# EasyEDA Pro project ProPrj_ExternalProgrammer.epro

# Schematic Schematic1
Board Name: Board1; Create Date: 2026-05-19; Page Name: P1; Project Name: ExternalProgrammer; Schematic Name: Schematic1; Update Date: 2026-05-19; Company: EasyEDA.com; Page Size: A4; Version: V1.0
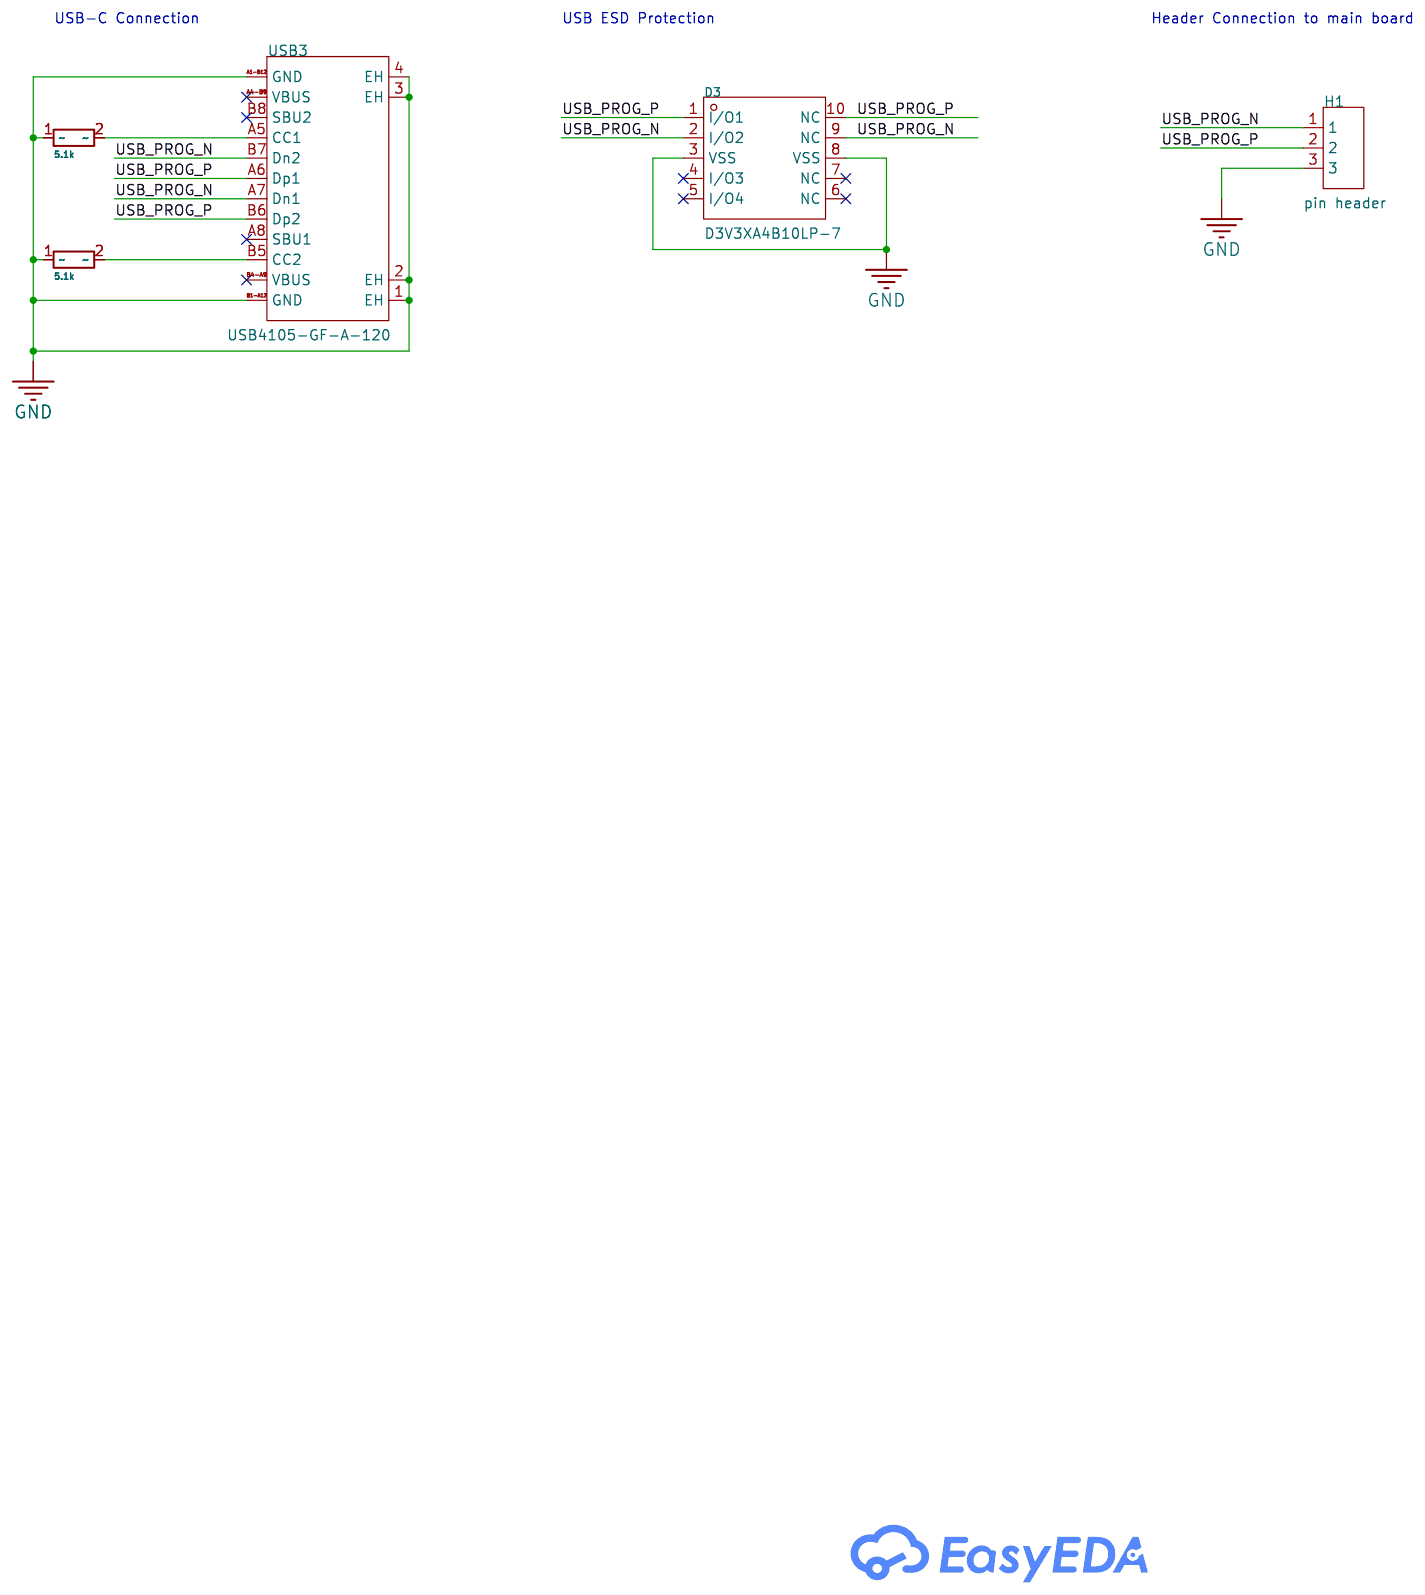
[diagram p0: schematic sheet]

## Parts
D3  D3V3XA4B10LP-7  [U-DFN2510-10_L2.5-W1.0-P0.50-BL]
H1  pin header  [HDR-TH_3P-P2.54-V-M-1]
R38  5.1k  [Resistor_SMD:R_0805_2012Metric]
R40  5.1k  [Resistor_SMD:R_0805_2012Metric]
USB3  USB4105-GF-A-120  [USB-C-SMD_MC-311D]

## Library data of the parts
D3 = D3V3XA4B10LP-7: Reverse Stand-Off Voltage (Vrwm):3.3V Maximum Clamping Voltage:9.4V Peak Pulse Current (Ipp)@10/1000us:4A@(8/20us) Peak Pulse Power Dissipation (Ppp)@10/1000us:24W Breakdown Voltage:5V Number of Lines:Quad Operating Temperature:-55℃~+150℃@(Tj) Operating T; Supplier Part: C1980462; Manufacturer: DIODES(美台); Supplier Footprint: UDFN2510-10; JLCPCB Part Class: Extended Part; Datasheet: https://atta.szlcsc.com/upload/public/pdf/source/20210612/4E7C5813EAA5EA71D504F2B0FA5443D6.pdf; Supplier: LCSC; Reverse Stand-Off Voltage (Vrwm): 3.3V; Maximum Clamping Voltage: 9.4V; Peak Pulse Current (Ipp)@10/1000us: 4A@(8/20us); Peak Pulse Power Dissipation (Ppp)@10/1000us: 24W; Breakdown Voltage: 5V; Number of Lines: Quad; Operating Temperature: -55℃~+150℃@(Tj); Type: ESD
H1 = HX PH254-01-03-Z-L11.5 pcb pin header: Pin Structure:1x3P Pitch:2.54mm Circluar Pins/Square Pins:Pin Header Mounting Type:Through Hole Number of Rows:1 Number of Pins:3P Current Rating:3A Voltage Rating (Max):1kV Length of Mating Pin:6mm Insulation Height:2.5mm Length of End Connection Pin:3mm; LCSC Part Name: 1x3P 间距:2.54mm 方针 直插; Supplier Part: C52016391; Manufacturer: hanxia(韩下); Supplier Footprint: 插件,P=2.54mm; JLCPCB Part Class: Extended Part; Datasheet: https://item.szlcsc.com/datasheet/HX%2520PH254-01-03-Z-L11.5%2520pcb%2520pin%2520header/54760436.html; Supplier: LCSC; Pin Structure: 1x3P; Pitch: 2.54mm; Circluar Pins/Square Pins: Pin Header; Mounting Type: Through Hole; Number of Rows: 1; Number of Pins: 3P; Current Rating: 3A; Voltage Rating (Max): 1kV; Length of Mating Pin: 6mm; Insulation Height: 2.5mm; Length of End Connection Pin: 3mm; Contact Material: Brass; Contact Plating: Gold; Operating Temperature: -40℃~+105℃
R38 R40 = Device_R: Attribute1: R16
USB3 = USB4105-GF-A-120: Connector Type:Type-C Protocol Standard:USB 2.0 Gender:Female Mounting Type:- Number of Contacts:16P Number of Ports:1 Current Rating-Power:5A Voltage Rating:48V Connect-Disconnect Life:- Supplementary Features:- Center Height:- Length:- Detection color:B; LCSC Part Name: Type-C 母; Supplier Part: C5184243; Manufacturer: GCT; Supplier Footprint: SMD; JLCPCB Part Class: Extended Part; Datasheet: https://item.szlcsc.com/datasheet/USB4105-GF-A-120/5849584.html; Supplier: LCSC; Connector Type: Type-C; Protocol Standard: USB 2.0; Gender: Female; Number of Contacts: 16P; Number of Ports: 1; Current Rating-Power: 5A; Voltage Rating: 48V; Detection color: Black; Operating Temperature: -40℃~+85℃

## Nets
GND: D3.3(VSS) D3.8(VSS) H1.3 R38.1 R40.1 USB3.1(EH) USB3.2(EH) USB3.3(EH) USB3.4(EH) USB3.A1-B12(GND) USB3.B1-A12(GND)
USB_PROG_N: D3.2(I/O2) D3.9(NC) H1.1 USB3.A7(Dn1) USB3.B7(Dn2)
USB_PROG_P: D3.1(I/O1) D3.10(NC) H1.2 USB3.A6(Dp1) USB3.B6(Dp2)
$1N501: R38.2 USB3.B5(CC2)
$1N502: R40.2 USB3.A5(CC1)

Not connected (* = marked no-connect by the designer): D3 4(I/O3)* 5(I/O4)* 6(NC)* 7(NC)*; USB3 A4-B9(VBUS)* A8(SBU1)* B4-A9(VBUS)* B8(SBU2)*

## Notes on the sheet
- USB-C Connection
- USB ESD Protection
- Header Connection to main board

# Board PCB1
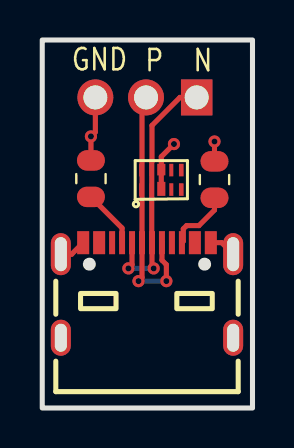
[diagram p1: board, top side]
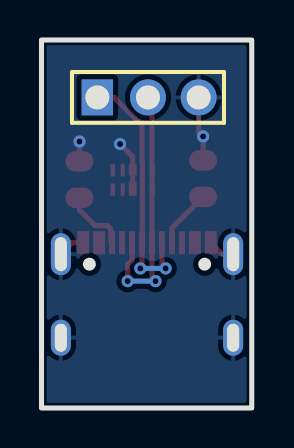
[diagram p2: board, bottom side, seen from below]

Outline 10.54 x 18.41 mm; copper layers: Top Layer, Bottom Layer. Coordinates in mm from the lower left corner of the outline.
Outline path: rectangle 0,18.41 10.54,0
Stack: Top Layer 0.035mm / Dielectric1 1.51mm FR4 er 4.5 / Bottom Layer 0.035mm

## Design rules (mm)
net USB_PROG_P: USB_PROG_
net USB_PROG_N: USB_PROG_
template: JLCPCB Capability(Two Layers Board)
spacing copperThickness1oz (default): track to track 0.102, other pairs 0.152 to 0.3
spacing copperThickness2oz: track to track 0.203, other pairs 0.152 to 0.3
track width copperThickness1oz (default): min 0.127, default 0.254, max 2.54
track width copperThickness2oz: min 0.203, default 0.254, max 2.54
differential pair differentialPair (default): width min 0.127, default 0.254, max 2.54; gap min 0.152, default 0.152
via viaSize (default): diameter min 0.5, default 0.61, max 10; hole min 0.3, default 0.305, max 6.3

## Placement (name value [footprint] x y rotation side)
D3  D3V3XA4B10LP-7  [U-DFN2510-10_L2.5-W1.0-P0.50-BL]  5.97 11.43 0 top
H1  pin header  [HDR-TH_3P-P2.54-V-M-1]  5.2 15.54 180 bottom
R38  5.1k  [Resistor_SMD:R_0805_2012Metric]  8.64 11.43 270 top
R40  5.1k  [Resistor_SMD:R_0805_2012Metric]  2.44 11.48 270 top
USB3  USB4105-GF-A-120  [USB-C-SMD_MC-311D]  5.25 5.89 0 top

## Footprints (pads in the part's own frame, mm; a bottom-side part is the same pattern mirrored in y, then rotated)
HDR-TH_3P-P2.54-V-M-1
  rect 1.575x1.8 hole 1.2: 1(-2.54,0)
  round 1.8 hole 1.2: 2(0,0) 3(2.54,0)
Resistor_SMD:R_0805_2012Metric
  rrect 1.025x1.4 smd: 1(-0.912,0) 2(0.912,0)
U-DFN2510-10_L2.5-W1.0-P0.50-BL
  rect 0.23x0.625 smd: 1(-1,-0.5) 5(1,-0.5) 6(1,0.475) 10(-1,0.475)
  rect 0.2x0.625 smd: 2(-0.5,-0.5) 4(0.5,-0.5) 7(0.5,0.475) 9(-0.5,0.475)
  rect 0.4x0.7 smd: 3(0,-0.464)
  rect 0.4x0.575 smd: 8(0,0.5)
USB-C-SMD_MC-311D
  oval 1x2.1 hole 0.6x1.7: 1(-4.32,1.802) 4(4.32,1.802)
  oval 1x1.8 hole 0.6x1.4: 2(-4.32,-2.377) 3(4.32,-2.377)
  rect 0.6x1.15 smd: A1-B12(-3.2,2.377) A4-B9(-2.4,2.377) B1-A12(3.2,2.377) B4-A9(2.4,2.377)
  rect 0.3x1.15 smd: A5(-1.25,2.377) A6(-0.25,2.377) A7(0.25,2.377) A8(1.25,2.377) B5(1.75,2.377) B6(0.75,2.377) B7(-0.75,2.377) B8(-1.75,2.377)

## Nets
As in the schematic.

Pads without a net: D3 4 5 6 7; USB3 A4-B9 A8 B4-A9 B8

## Via types
v1: diameter 0.61, hole 0.305, Top Layer to Bottom Layer, 7 vias

## Routing (per net, layer and track width the routed paths; a pad name or vN(x,y) marks a point on that pad's centre or on a via; arc(x,y) is an arc through that point)
GND: length 9.5
  Top Layer w0.254: USB3.B1-A12 9,8.27 USB3.4 ; USB3.1 1.48,7.7 USB3.A1-B12 ; H1.3 2.66,13.81 v1(2.44,13.59) R40.1 ; v1(6.6,13.21) 5.97,12.57 D3.8 D3.3 ; R38.1 v1(8.64,13.33)
USB_PROG_N: length 12.6
  Top Layer w0.254: USB3.B7 4.5,7.17 v1(4.32,6.98) ; v1(5.59,6.98) 5.5,7.07 USB3.A7 5.49,8.28 5.49,12.33 5.5,12.34 5.5,14.14 6.91,15.54 H1.1
  Bottom Layer w0.254: v1(4.32,6.98) v1(5.59,6.98)
USB_PROG_P: length 12.8
  Top Layer w0.254: H1.2 5,15.34 USB3.A6 5,6.53 v1(4.83,6.35) ; v1(6.22,6.35) 6.22,7.17 6,7.39 USB3.B6
  Bottom Layer w0.254: v1(6.22,6.35) v1(4.83,6.35)
$1N501: length 3.3
  Top Layer w0.254: R38.2 8.64,9.91 7.86,9.13 7.24,9.13 7.07,8.96 7.07,8.34 USB3.B5
$1N502: length 2.9
  Top Layer w0.254: R40.2 4,9 USB3.A5

## Copper pours and planes (outline as drawn; the poured copper is in the pictures)
GND on Bottom Layer: -0.76,18.92 11.81,18.92 11.81,-0.76 -0.76,-0.76

## Text on the board
Top Silkscreen Layer: GND | P | N
